# EAGLE design ca_ca (EAGLE 9.6.2)
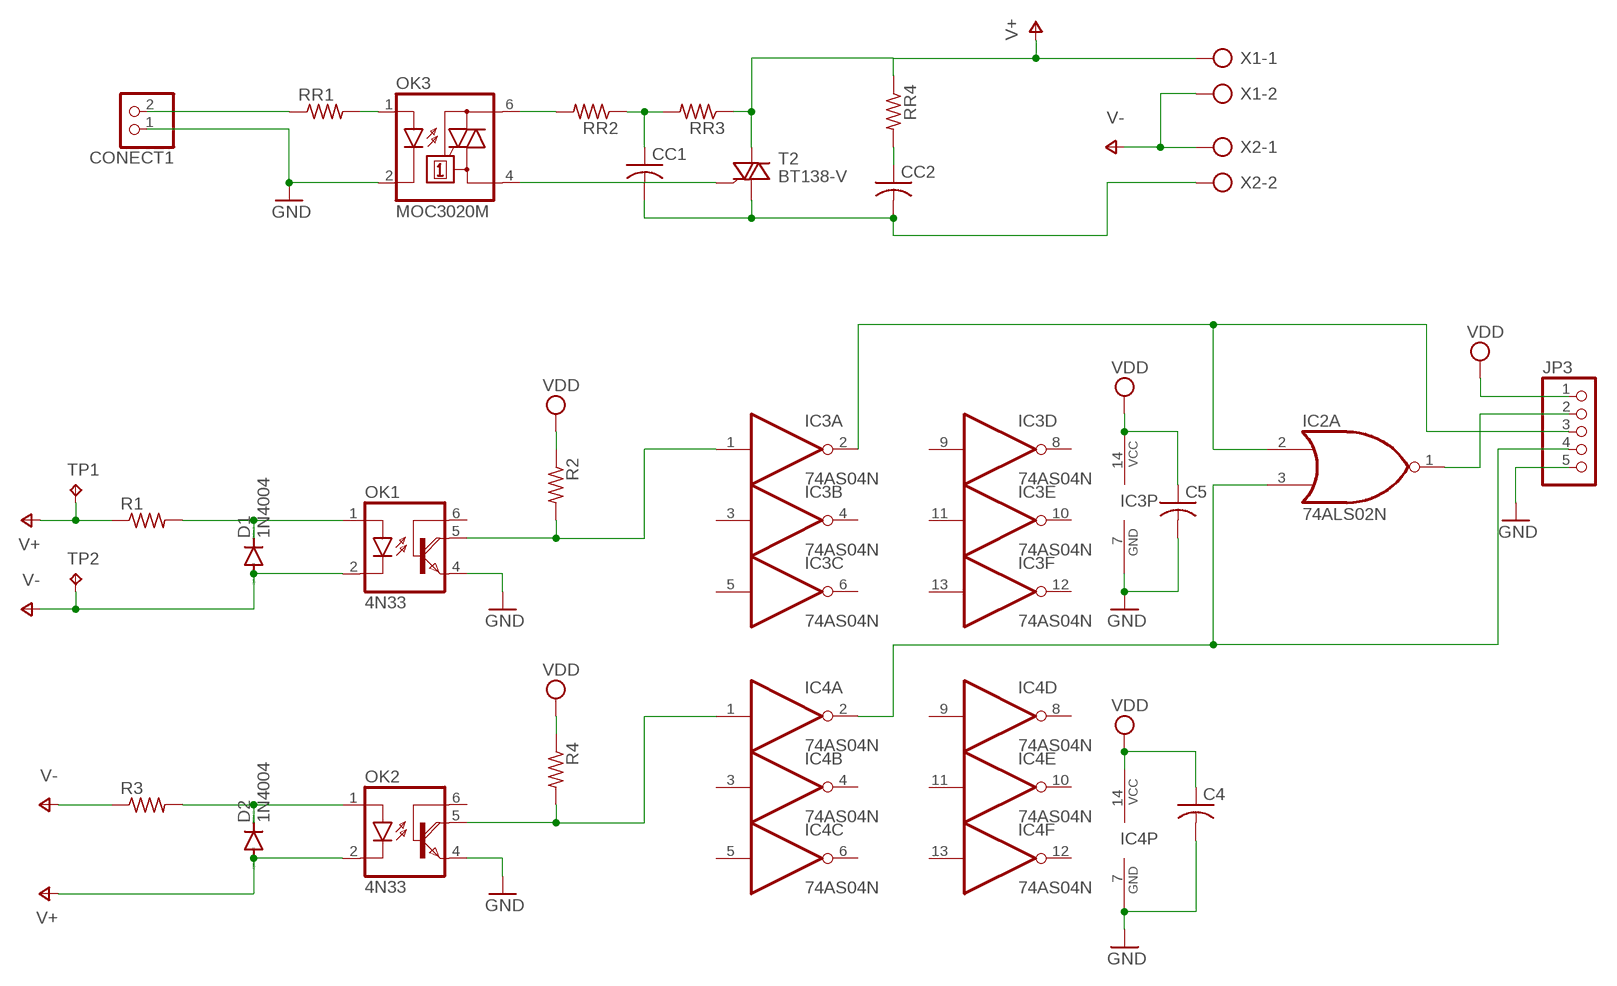
[diagram p0: schematic, sheet 1]

## Parts
C4  C-US102-064X133  [C102-064X133]
C5  C-US102-064X133  [C102-064X133]
CC1  C-US102-064X133  [C102-064X133]
CC2  C-US102-064X133  [C102-064X133]
CONECT1  PINHD-1X2  [1X02]
D1  1N4004  [DO41-10]
D2  1N4004  [DO41-10]
IC2  74ALS02N  [DIL14]
IC3  74AS04N  [DIL14]
IC4  74AS04N  [DIL14]
JP3  PINHD-1X5  [1X05]
OK1  4N33  [DIL06]
OK2  4N33  [DIL06]
OK3  MOC3020M  [DIL06]
R1  R-US_0617/22  [0617/22]
R2  R-US_0617/22  [0617/22]
R3  R-US_0617/22  [0617/22]
R4  R-US_0617/22  [0617/22]
RR1  R-US_0617/22  [0617/22]
RR2  R-US_0617/22  [0617/22]
RR3  R-US_0617/22  [0617/22]
RR4  R-US_0617/22  [0617/22]
T2  BT138-V  [TO220BV]
TP1  TPPAD1-17Y  [P1-17Y]
TP2  TPPAD1-17Y  [P1-17Y]
X1  AK500/2-H  [AK500/2-H]
X2  AK500/2-H  [AK500/2-H]

## Nets
GND: C4.2 C5.2 CONECT1.1 IC3.7(P:GND) IC4.7(P:GND) JP3.5 OK1.4(E) OK2.4(E) OK3.2(C)
N$1: OK3.1(A) RR1.2
N$2: CONECT1.2 RR1.1
N$3: OK3.4(A1) T2.G
N$4: CC1.1 RR2.1 RR3.2
N$5: OK3.6(A2) RR2.2
N$6: IC3.1(A:I) OK1.5(COL) R2.2
N$7: CC1.2 CC2.2 T2.T1(A1) X2.2
N$8: CC2.1 RR4.2
N$9: D1.C OK1.1(A) R1.2
N$10: IC2.2(A:I0) IC3.2(A:O) JP3.3
N$11: IC4.1(A:I) OK2.5(COL) R4.2
N$12: D2.C OK2.1(A) R3.2
N$13: IC2.3(A:I1) IC4.2(A:O) JP3.4
N$14: IC2.1(A:O) JP3.2
V+: D2.A OK2.2(C) R1.1 RR3.1 RR4.1 T2.T2(A2) TP1.TP X1.1
V-: D1.A OK1.2(C) R3.1 TP2.TP X1.2 X2.1
VDD: C4.1 C5.1 IC3.14(P:VCC) IC4.14(P:VCC) JP3.1 R2.1 R4.1
Unconnected: IC2.4(B:O) IC2.5(B:I0) IC2.6(B:I1) IC2.8(C:I0) IC2.9(C:I1) IC2.10(C:O) IC2.11(D:I0) IC2.12(D:I1) IC2.13(D:O) IC3.3(B:I) IC3.4(B:O) IC3.5(C:I) IC3.6(C:O) IC3.8(D:O) IC3.9(D:I) IC3.10(E:O) IC3.11(E:I) IC3.12(F:O) IC3.13(F:I) IC4.3(B:I) IC4.4(B:O) IC4.5(C:I) IC4.6(C:O) IC4.8(D:O) IC4.9(D:I) IC4.10(E:O) IC4.11(E:I) IC4.12(F:O) IC4.13(F:I) OK1.6(B) OK2.6(B)

## Power pins joined to a net without a drawn wire
GND: IC2.7(P:GND)
VCC: IC2.14(P:VCC)

## Library data of the parts
C4 C5 CC1 CC2 = rcl:C-US: CAPACITOR, American symbol; SPICEPREFIX: C
CONECT1 = pinhead:PINHD-1X2: PIN HEADER
D1 D2 = diode:1N4004: DIODE general purpose rectifier, 1 A
IC2 = 74xx-us:74*02: Quad 2-input NOR gate
IC3 IC4 = 74xx-us:74*04: Hex INVERTER
JP3 = pinhead:PINHD-1X5: PIN HEADER
OK1 OK2 = optocoupler:4N33: MOTOROLA OPTO COUPLER; MF: VISHAY/TELEFUNKEN; MPN: 4N33; OC_FARNELL: 1469601; OC_NEWARK: 88K1390
OK3 = optocoupler:MOC30*M: RANDOM-PHASE OPTOISOLATORS TRIAC DRIVER OUTPUT Source: http://www.fairchildsemi.com MOC3020-M.pdf; MF: FAIRCHILD SEMICONDUCTOR; MPN: MOC3020-M; OC_FARNELL: 1505425; OC_NEWARK: 72K8895
R1-R4 RR1-RR4 = rcl:R-US_: RESISTOR, American symbol; SPICEPREFIX: R
T2 = triac:BT138: TRIAC Source: http://www.semiconductors.philips.com BT138_SERIES_2.pdf
TP1 TP2 = testpad:TP: Test pad
X1 X2 = con-ptr500:AK500/2-H: CONNECTOR Aug. 2004 / PTR Meßtechnik: Die Bezeichnung der Serie AK505 wurde geändert. Es handelt sich hierbei um AK500 in horizontaler Ausführung.; OC_FARNELL: unknown; OC_NEWARK: unknown

## Board
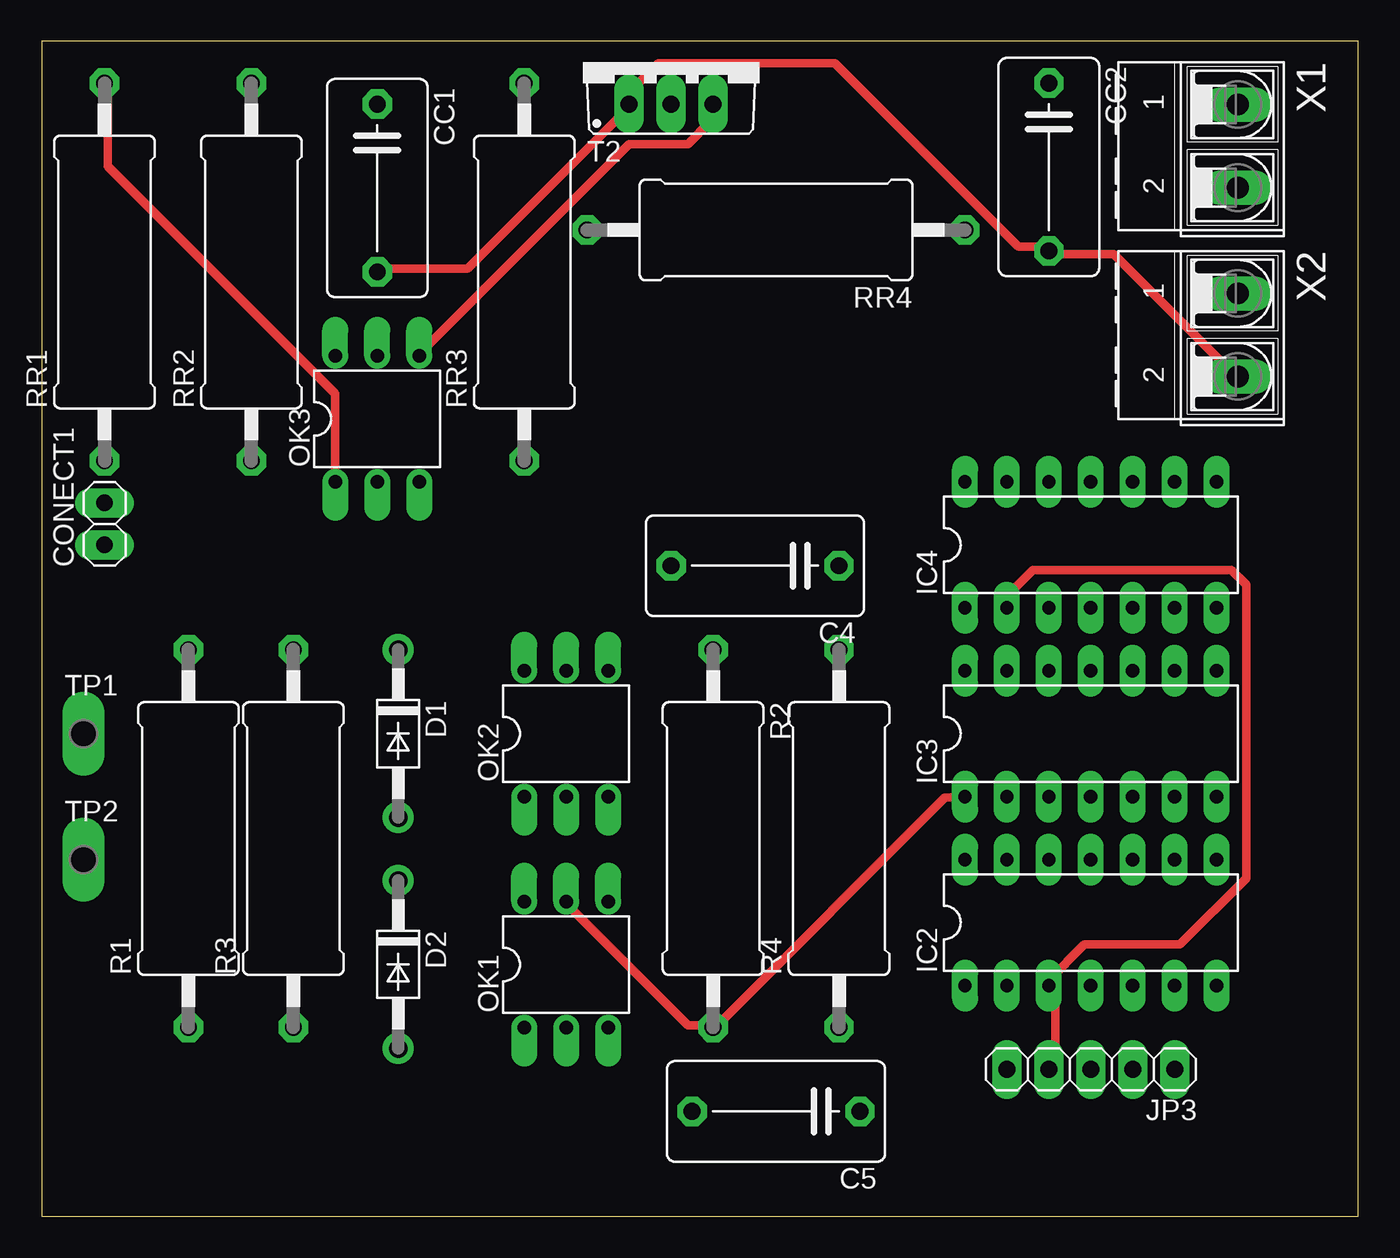
[diagram p1: board, top side]
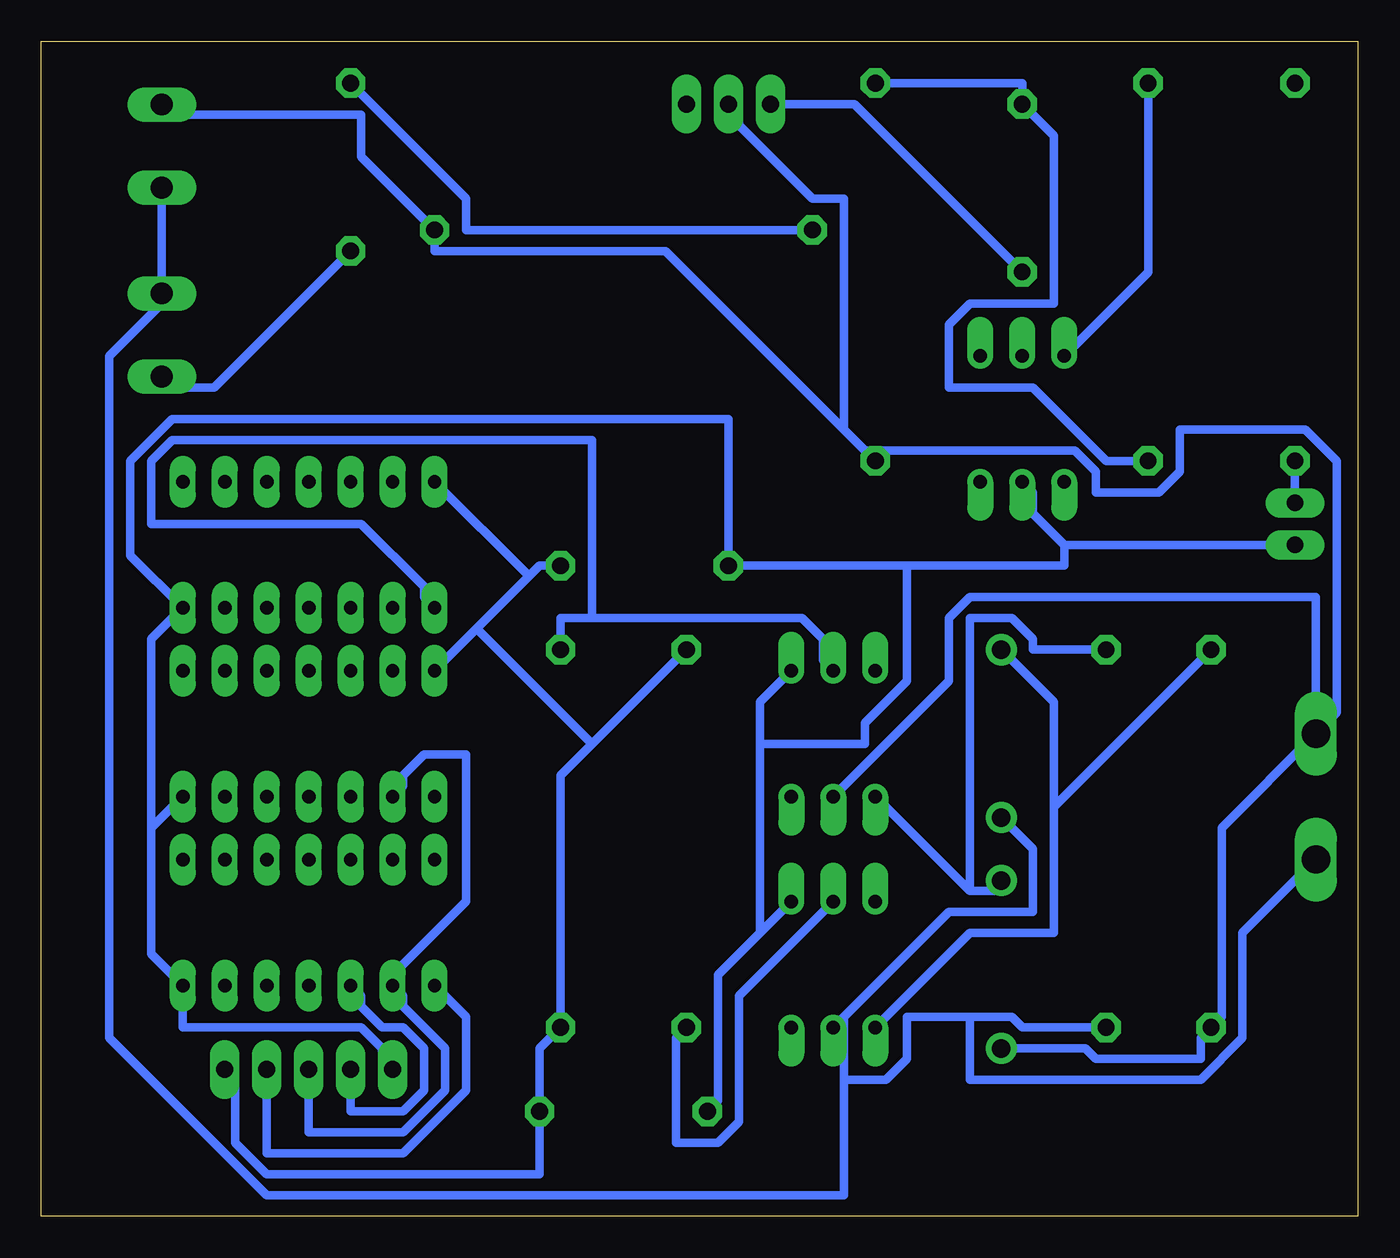
[diagram p2: board, bottom side, seen from below]

Size 79.68 x 71.11 mm. Coordinates in mm from the lower left corner, seen from the top.
Outline: 0,0 79.68,0 79.68,71.11 0,71.11 0,0
Copper layers (1*16): Top 0.035mm / dielectric 1.5mm / Bottom 0.035mm
Design rules "default *": minimum track width 20mil, minimum drill 0.8mm, track to track 15mil, track to pad 15mil, pad to pad 15mil, via to via 15mil, smd to smd 6mil, copper to edge 40mil, drill to drill 6mil, minimum pad ring 15mil, minimum via ring 20mil, stop-mask expansion 4mil, vias tented up to drill 0mil, thermal gap 10mil

### Footprints (pad centres in the part's own frame; a part is rotated, then mirrored left to right if it is on the bottom)
C102-064X133 = drill 1.016 octagon: 1 -5.08,0; 2 5.08,0
1X02 = drill 1.016 long: 1 -1.27,0; 2 1.27,0
DO41-10 = drill 1.118: A 5.08,0; C -5.08,0
DIL14 = drill 0.813 long: 1 -7.62,-3.81; 2 -5.08,-3.81; 3 -2.54,-3.81; 4 0,-3.81; 5 2.54,-3.81; 6 5.08,-3.81; 7 7.62,-3.81; 8 7.62,3.81; 9 5.08,3.81; 10 2.54,3.81; 11 0,3.81; 12 -2.54,3.81; 13 -5.08,3.81; 14 -7.62,3.81
1X05 = drill 1.016 long: 1 -5.08,0; 2 -2.54,0; 3 0,0; 4 2.54,0; 5 5.08,0
DIL06 = drill 0.813 offset: 1 -2.54,-3.81; 2 0,-3.81; 3 2.54,-3.81; 4 2.54,3.81; 5 0,3.81; 6 -2.54,3.81
0617/22 = drill 1.016 octagon: 1 -11.43,0; 2 11.43,0
TO220BV = drill 1.016 long: G 2.54,-2.54; T1 -2.54,-2.54; T2 0,-2.54
P1-17Y = drill 1.702 pad 2.121 long: TP 0,0
AK500/2-H = drill 1.321 long: 1 -2.515,0; 2 2.515,0

### Placement (x,y rotation side)
C4  43.18,39.37 180 top
C5  44.45,6.35 180 top
CC1  20.32,62.23 270 top
CC2  60.96,63.5 270 top
CONECT1  3.81,41.91 90 top
D1  21.59,29.21 270 top
D2  21.59,15.24 270 top
IC2  63.5,17.78 0 top
IC3  63.5,29.21 0 top
IC4  63.5,40.64 0 top
JP3  63.5,8.89 180 top
OK1  31.75,15.24 0 top
OK2  31.75,29.21 0 top
OK3  20.32,48.26 0 top
R1  8.89,22.86 90 top
R2  40.64,22.86 270 top
R3  15.24,22.86 90 top
R4  48.26,22.86 90 top
RR1  3.81,57.15 90 top
RR2  12.7,57.15 90 top
RR3  29.21,57.15 90 top
RR4  44.45,59.69 180 top
T2  38.1,69.85 0 top
TP1  2.54,29.21 0 top
TP2  2.54,21.59 0 top
X1  72.39,64.77 270 top
X2  72.39,53.34 270 top

### Tracks (layer width: path | path; a pad name or v marks a point on that pad's centre or on a via)
GND
  Bottom 0.508: 73.03,23.49 73.03,15.88 IC2.7 71.12,11.43 60.33,11.43 59.05,10.16 59.05,9.52 JP3.5 | IC3.7 73.03,23.49 | 73.03,23.49 73.03,34.92 IC4.7 74.3,40.01 74.3,45.72 71.75,48.26 38.1,48.26 C4.2 27.3,39.37 | 36.2,17.14 38.73,14.61 38.73,6.98 C5.2 | 36.2,17.14 OK1.4 | OK2.4 36.2,31.12 36.2,28.58 | 36.2,17.14 36.2,28.58 | OK3.2 19.68,43.81 19.68,42.55 17.78,40.64 | CONECT1.1 17.78,40.64 | 27.3,39.37 17.78,39.37 17.78,40.64 | 36.2,28.58 29.84,28.58 29.84,29.84 27.3,32.38 27.3,39.37
N$1
  Top 0.508: OK3.1 17.78,49.78 4,63.56 4,68.45 RR1.2
N$2
  Bottom 0.508: RR1.1 CONECT1.2
N$3
  Top 0.508: OK3.4 23.11,52.45 35.56,64.9 39.12,64.9 40.45,66.23 40.45,67.12 T2.G
N$4
  Bottom 0.508: RR2.1 15.24,45.72 19.68,50.16 24.77,50.16 24.77,53.98 23.5,55.25 18.41,55.25 18.41,65.41 CC1.1 20.32,68.58 RR3.2
N$5
  Bottom 0.508: OK3.6 12.7,57.15 RR2.2
N$6
  Top 0.508: OK1.5 32,18.67 39.12,11.56 40.45,11.56 R2.2 40.89,11.56 54.67,25.34 55.56,25.34 IC3.1
  Bottom 0.508: OK1.5 37.47,13.34 37.47,5.71 38.73,4.45 41.27,4.45 41.27,10.79 R2.2
N$7
  Top 0.508: X2.2 72.01,51.12 64.9,58.23 61.34,58.23 CC2.2 60.9,58.67 59.12,58.67 48.01,69.79 37.34,69.79 35.56,68.01 T2.T1 35.56,67.12 25.78,57.34 20.45,57.34 CC1.2
  Bottom 0.508: CC1.2 30.48,67.31 T2.T1 | CC2.2 69.22,50.16 72.39,50.16 X2.2
N$8
  Bottom 0.508: RR4.2 53.98,59.69 53.98,61.59 CC2.1
N$9
  Bottom 0.508: OK1.1 23.5,17.14 18.41,17.14 18.41,24.77 | 18.41,24.77 18.41,31.12 D1.C | 18.41,24.77 R1.2
N$10
  Bottom 0.508: JP3.3 63.5,5.08 57.78,5.08 55.24,7.62 55.24,10.16 57.78,12.7 57.78,13.34 IC2.2 58.42,14.61 53.98,19.05 53.98,27.94 56.52,27.94 57.78,26.67 57.78,26.03 IC3.2
N$11
  Bottom 0.508: OK2.5 32.38,33.66 32.38,34.92 33.66,36.2 46.35,36.2 | 46.35,36.2 48.26,36.2 R4.2 | IC4.1 56.52,37.46 56.52,38.1 60.33,41.91 73.03,41.91 73.03,45.72 71.75,46.99 46.35,46.99 46.35,36.2
N$12
  Bottom 0.508: 23.5,19.68 OK2.1 | 23.5,19.68 21.59,19.68 D2.C | R3.2 19.68,34.29 19.68,34.92 20.95,36.2 23.5,36.2 23.5,19.68
N$13
  Top 0.508: IC4.2 58.67,36.89 58.67,37.78 60.01,39.12 72.01,39.12 72.9,38.23 72.9,20.45 68.9,16.45 63.12,16.45 60.9,14.22 IC2.3 61.34,13.78 61.34,8.89 JP3.4
  Bottom 0.508: IC2.3 60.33,13.34 60.33,12.7 59.05,11.43 57.78,11.43 56.52,10.16 56.52,7.62 57.78,6.35 60.96,6.35 JP3.4
N$14
  Bottom 0.508: IC2.1 53.98,12.06 53.98,7.62 57.78,3.81 66.04,3.81 JP3.2
V+
  Bottom 0.508: OK2.2 24.77,32.38 24.77,36.2 23.5,37.46 2.54,37.46 TP1.TP | TP1.TP 8.26,23.49 8.26,12.06 R1.1 9.53,10.79 9.53,9.52 15.88,9.52 16.51,10.16 D2.A | 31.11,47.62 41.91,58.42 55.88,58.42 RR4.1 60.33,64.14 60.33,66.67 72.39,66.67 X1.1 | 31.11,47.62 29.84,46.35 | 29.84,46.35 RR3.1 | T2.T2 37.47,66.67 37.47,66.04 33.02,61.59 31.11,61.59 31.11,47.62 | TP1.TP 1.27,30.48 1.27,45.72 3.17,47.62 10.79,47.62 10.79,45.09 12.06,43.81 15.88,43.81 15.88,45.09 17.14,46.35 29.84,46.35
V-
  Bottom 0.508: X1.2 X2.1 72.39,55.25 75.56,52.07 75.56,10.79 66.04,1.27 31.11,1.27 31.11,8.25 | 31.11,12.06 24.77,18.41 19.68,18.41 19.68,22.22 D1.A | 31.11,12.06 OK1.2 | R3.1 20.32,11.43 20.95,12.06 23.5,12.06 | 23.5,12.06 27.3,12.06 27.3,9.52 28.57,8.25 31.11,8.25 | 31.11,12.06 31.11,8.25 | TP2.TP 6.99,17.14 6.99,10.79 9.53,8.25 23.5,8.25 23.5,12.06
VDD
  Bottom 0.508: 50.16,38.73 49.53,39.37 C4.1 | 50.16,38.73 53.34,35.56 | 53.34,35.56 IC3.14 | 50.16,38.73 IC4.14 | JP3.1 67.94,8.25 67.94,4.45 66.04,2.54 49.53,2.54 C5.1 49.53,10.16 R4.1 48.26,26.67 46.35,28.58 | 46.35,28.58 R2.1 | 46.35,28.58 53.34,35.56